# EAGLE schematic Nusbio1.0.WaveShare.WithLed.SeedStudio (EAGLE 7.6.0)
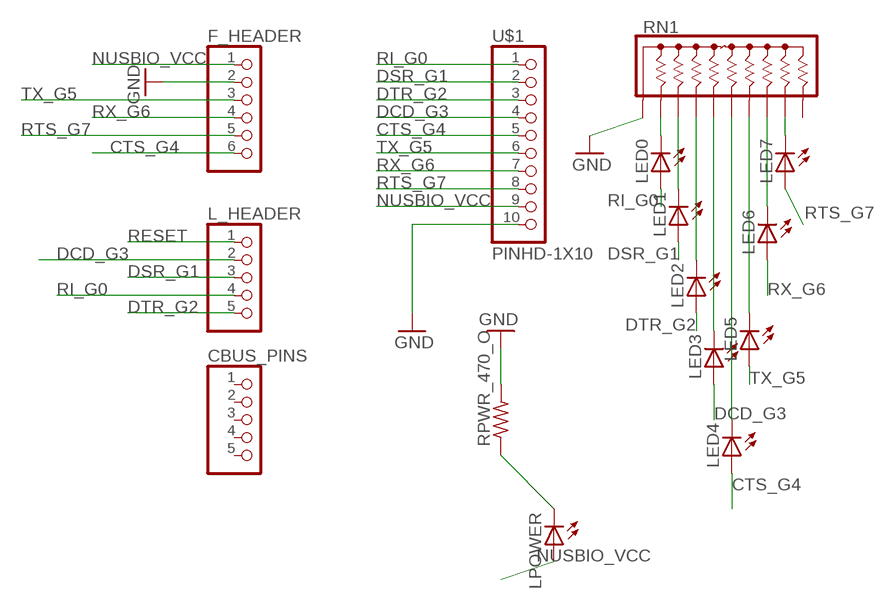
[diagram p0: schematic, sheet 1]

## Parts
CBUS_PINS  PINHD-1X5  [1X05]
F_HEADER  PINHD-1X6  [1X06]
L_HEADER  PINHD-1X5  [1X05]
LED0  LEDSMT1206  [1206]
LED1  LEDSMT1206  [1206]
LED2  LEDSMT1206  [1206]
LED3  LEDSMT1206  [1206]
LED4  LEDSMT1206  [1206]
LED5  LEDSMT1206  [1206]
LED6  LEDSMT1206  [1206]
LED7  LEDSMT1206  [1206]
LPOWER  LEDSMT1206  [1206]
RN1  4610X  [SIP10]
RPWR_470_O  R-US_R1206  [R1206]
U$1  PINHD-1X10  [1X10-BIG]

## Nets
CTS_G4: F_HEADER.6 LED4.A U$1.5
DCD_G3: L_HEADER.2 LED3.A U$1.4
DSR_G1: L_HEADER.3 LED1.A U$1.2
DTR_G2: L_HEADER.5 LED2.A U$1.3
GND: F_HEADER.2 RN1.1 RPWR_470_O.2 U$1.10
N$1: LED1.C RN1.3
N$2: LED0.C RN1.2
N$3: LED2.C RN1.4
N$4: LED3.C RN1.5
N$5: LED4.C RN1.6
N$6: LED7.C RN1.9
N$7: LED5.C RN1.7
N$8: LED6.C RN1.8
N$9: LPOWER.C RPWR_470_O.1
NUSBIO_VCC: F_HEADER.1 LPOWER.A U$1.9
RESET: L_HEADER.1
RI_G0: L_HEADER.4 LED0.A U$1.1
RTS_G7: F_HEADER.5 LED7.A U$1.8
RX_G6: F_HEADER.4 LED6.A U$1.7
TX_G5: F_HEADER.3 LED5.A U$1.6
Unconnected: CBUS_PINS.1 CBUS_PINS.2 CBUS_PINS.3 CBUS_PINS.4 CBUS_PINS.5 RN1.10

## Library data of the parts
CBUS_PINS L_HEADER = pinhead:PINHD-1X5: PIN HEADER
F_HEADER = adafruit:PINHD-1X6: PIN HEADER
LED0 LED1-LED7 LPOWER = adafruit:LED: LED OSRAM: - CHIPLED LG R971, LG N971, LY N971, LG Q971, LY Q971, LO R971, LY R971 LH N974, LH R974 LS Q976, LO Q976, LY Q976 LO Q996 - Hyper CHIPLED LW Q18S LB Q993, LB Q99A, LB R99A - SideLED LS A670, LO A670, LY A670, LG A670, LP A670 LB A673, LV A673, LT A673, LW A673 LH A674 LY A675 LS A676, LA A676, LO A676, LY A676, LW A676 LS A679, LY A679, LG A679 - Hyper Micro SIDELED® LS Y876, LA Y876, LO Y876, LY Y876 LT Y87S - SmartLED LW L88C, LW L88S LB L89C, LB L89S, LG L890 LS L89K, LO L89K, LY L89K LS L896, LA L896, LO L896, LY L896 - TOPLED LS T670, LO T670, LY T670, LG T670, LP T670 LSG T670, LSP T670, LSY T670, LOP T670, LYG T670 LG T671, LOG T671, LSG T671 LB T673, LV T673, LT T673, LW T673 LH T674 LS T676, LA T676, LO T676, LY T676, LB T676, LH T676, LSB T676, LW T676 LB T67C, LV T67C, LT T67C, LS T67K, LO T67K, LY T67K, LW E67C LS E67B, LA E67B, LO E67B, LY E67B, LB E67C, LV E67C, LT E67C LW T67C LS T679, LY T679, LG T679 LS T770, LO T770, LY T770, LG T770, LP T770 LB T773, LV T773, LT T773, LW T773 LH T774 LS E675, LA E675, LY E675, LS T675 LS T776, LA T776, LO T776, LY T776, LB T776 LHGB T686 LT T68C, LB T68C - Hyper Mini TOPLED® LB M676 - Mini TOPLED Santana® LG M470 LS M47K, LO M47K, LY M47K Source: http://www.osram.convergy.de/
RN1 = resistor-sip:4610X: Bourns 4600X Series - Thick Film Conformal SIPs 4610X-101 Resistor Network Configuration: 101 (Bussed Resistors) Resistance range: 10 ohms to 10 Megaohms Maximum Operating Voltage: 100V Source: http://www.bourns.com/ProductLine.aspx?name=standard_thick_film_networks PDF: http://www.bourns.com/data/global/pdfs/4600X.pdf
RPWR_470_O = adafruit:R-US_: RESISTOR, American symbol
U$1 = adafruit:PINHD-1X10: Pin header 1x10 0.1" spacing With round pins